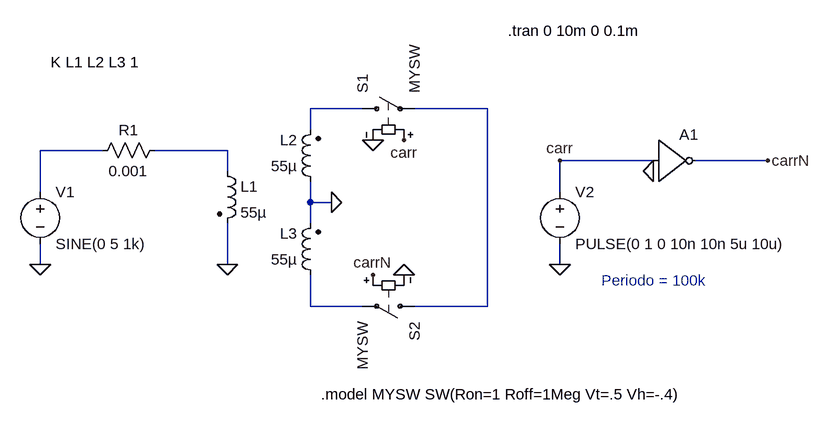
[diagram p0: schematic Draft5.asc]
Draft5.asc, the LTspice schematic file:
Version 4
SHEET 1 1292 680
WIRE 304 112 224 112
WIRE 496 112 384 112
WIRE 224 144 224 112
WIRE -96 176 -192 176
WIRE 96 176 -16 176
WIRE 752 192 608 192
WIRE 928 192 816 192
WIRE 96 208 96 176
WIRE -192 240 -192 176
WIRE 608 240 608 192
WIRE 224 256 224 224
WIRE 256 256 224 256
WIRE 224 288 224 256
WIRE -192 352 -192 320
WIRE 96 352 96 288
WIRE 608 352 608 320
WIRE 224 416 224 368
WIRE 304 416 224 416
WIRE 496 416 496 112
WIRE 496 416 384 416
FLAG -192 352 0
FLAG 608 352 0
FLAG 96 352 0
FLAG 256 256 0
FLAG 320 160 0
FLAG 368 368 0
FLAG 752 208 0
FLAG 928 192 carrN
FLAG 608 192 carr
FLAG 368 160 carr
FLAG 320 368 carrN
SYMBOL voltage -192 224 R0
SYMATTR InstName V1
SYMATTR Value SINE(0 5 1k)
SYMBOL voltage 608 224 R0
SYMATTR InstName V2
SYMATTR Value PULSE(0 1 0 10n 10n 5u 10u)
SYMBOL res 0 160 R90
WINDOW 0 0 56 VBottom 2
WINDOW 3 32 56 VTop 2
SYMATTR InstName R1
SYMATTR Value 0.001
SYMBOL ind2 80 192 R0
SYMATTR InstName L1
SYMATTR Value 55µ
SYMATTR Type ind
SYMBOL ind2 240 240 R180
WINDOW 0 36 80 Left 2
WINDOW 3 36 40 Left 2
SYMATTR InstName L2
SYMATTR Value 55µ
SYMATTR Type ind
SYMBOL ind2 240 384 R180
WINDOW 0 36 80 Left 2
WINDOW 3 36 40 Left 2
SYMATTR InstName L3
SYMATTR Value 55µ
SYMATTR Type ind
SYMBOL sw 288 112 R270
SYMATTR InstName S1
SYMATTR Value MYSW
SYMBOL sw 400 416 R90
SYMATTR InstName S2
SYMATTR Value MYSW
SYMBOL Digital/inv 752 128 R0
SYMATTR InstName A1
TEXT 528 -8 Left 2 !.tran 0 10m 0 0.1m
TEXT -176 40 Left 2 !K L1 L2 L3 1
TEXT 240 552 Left 2 !.model MYSW SW(Ron=1 Roff=1Meg Vt=.5 Vh=-.4)
TEXT 672 376 Left 2 ;Periodo = 100k

The netlist it stands for:
* Draft5.asc
V1 N003 0 SINE(0 5 1k)
V2 carr 0 PULSE(0 1 0 10n 10n 5u 10u)
R1 N004 N003 0.001
L1 N004 0 55µ
L2 0 N001 55µ
L3 N005 0 55µ
S1 N001 N002 carr 0 MYSW
S2 N002 N005 carrN 0 MYSW
A1 carr 0 0 0 0 carrN 0 0 BUF
.tran 0 10m 0 0.1m
K L1 L2 L3 1
.model MYSW SW(Ron=1 Roff=1Meg Vt=.5 Vh=-.4)
* Periodo = 100k
.backanno
.end